# EAGLE design f103Ard (EAGLE 4.13)
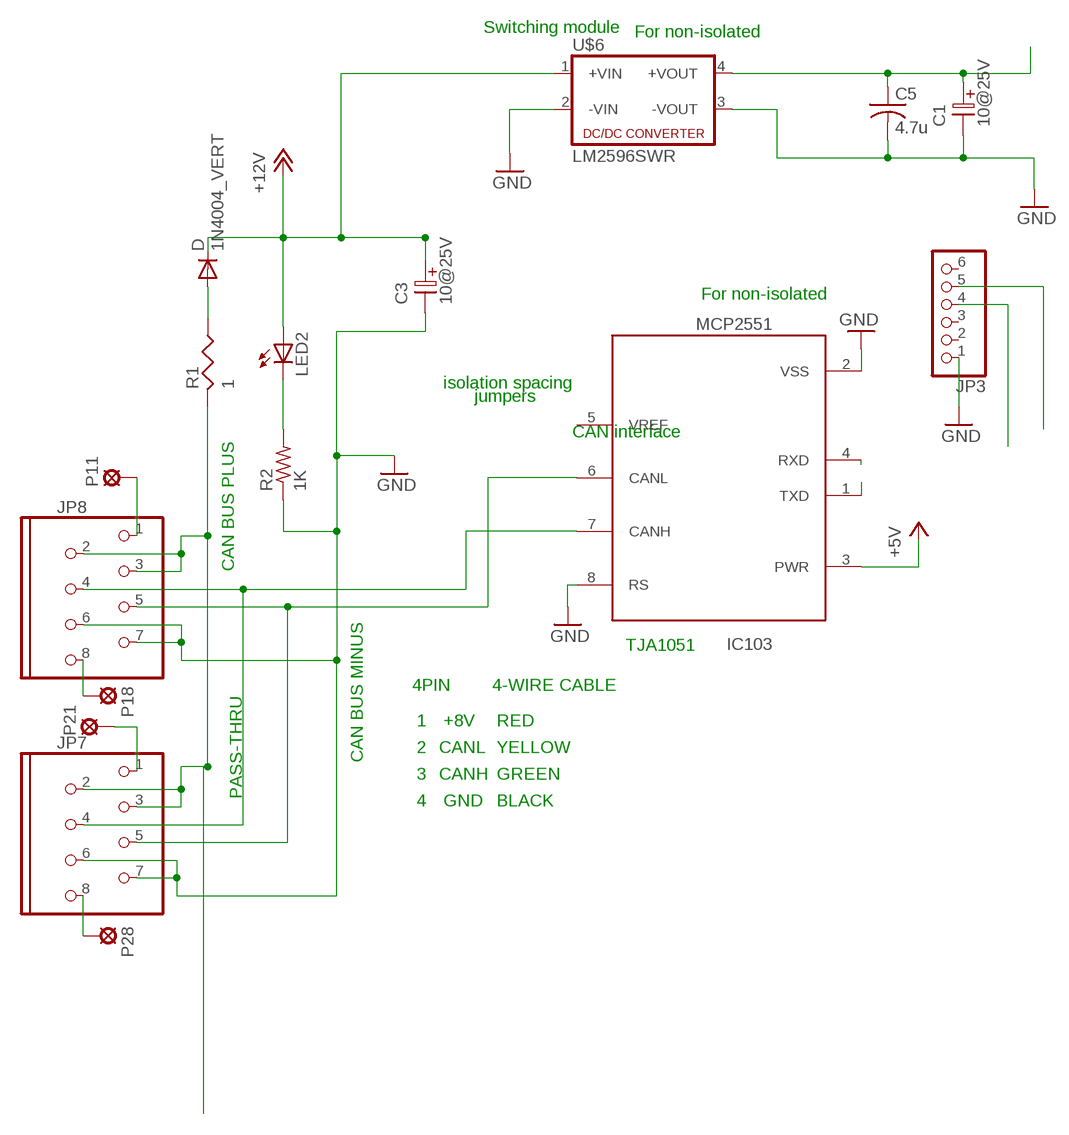
[diagram p0: schematic, sheet 1]

## Parts
C1  10@25V  ELC-2,5L  [ES-2,5L]
C3  10@25V  ELC-2,5L  [ES-2,5L]
C5  4.7u  C-USC0603  [C0603]
D  1N4004_VERT  [DO41-10_VERT]
IC103  MCP2551  [SO-08]
JP3  PINHD-1X6  [1X06]
JP7  MOD8P8C  [MOD8P8C]
JP8  MOD8P8C  [MOD8P8C]
LED2  LEDCHIPLED_0805  [CHIPLED_0805]
P11  SOLPAD035  [SOLDPAD035]
P18  SOLPAD035  [SOLDPAD035]
P21  SOLPAD035  [SOLDPAD035]
P28  SOLPAD035  [SOLDPAD035]
R1  1  RESUS-S2,5  [RS-2,5]
R2  1K  R-US_R0603  [R0603]
U$6  LM2596SWR  [LM2596SW]

## Nets
+5V: IC103.3(PWR)
+12V: C3.1 D.C LED2.A U$6.1(+VIN)
+12V_RESISTORED: D.A R1.1
CAN_RAW_PLUS: JP7.2 JP7.3 JP8.2 JP8.3 R1.2
CANCABLE_1_1: JP8.1 P11.MP
CANCABLE_1_8: JP8.8 P18.MP
CANCABLE_2_1: JP7.1 P21.MP
CANCABLE_2_8: JP7.8 P28.MP
CANRX: IC103.4(RXD)
CANTX: IC103.1(TXD)
GND: C1.2 C3.2 C5.2 IC103.2(VSS) IC103.8(RS) JP3.1 JP7.6 JP7.7 JP8.6 JP8.7 R2.1 U$6.2(-VIN) U$6.3(-VOUT)
LED_BUS_PWR: LED2.C R2.2
MCP2551_CANH: IC103.7(CANH) JP7.4 JP8.4
MCP2551_CANL: IC103.6(CANL) JP7.5 JP8.5
N$1: C1.1 C5.1 U$6.4(+VOUT)
PA9_USART1_TX: JP3.5
PA10_USART1_RX: JP3.4
Unconnected: IC103.5(VREF) JP3.2 JP3.3 JP3.6

## Notes on the sheet
- Switching module | For non-isolated
- For non-isolated
- isolation spacing
- jumpers
- CAN interface
- CAN BUS PLUS
- TJA1051
- PASS-THRU | 4PIN | 4-WIRE CABLE
- 1 | +8V | RED
- 2 | CANL | YELLOW
- CAN BUS MINUS
- 3 | CANH | GREEN
- 4 | GND | BLACK

## Library data of the parts
C1 C3 = DEH:ELC-2,5L
C5 = rcl:C-US: CAPACITOR, American symbol
D = diode:1N4004_VERT
IC103 = texas:MCP2551
JP3 = pinhead:PINHD-1X6: PIN HEADER
JP7 JP8 = DEH:MOD8P8C
LED2 = led:LED: LED OSRAM: - CHIPLED LG R971, LG N971, LY N971, LG Q971, LY Q971, LO R971, LY R971 LH N974, LH R974 LS Q976, LO Q976, LY Q976 LO Q996 - Hyper CHIPLED LW Q18S LB Q993, LB Q99A, LB R99A - SideLED LS A670, LO A670, LY A670, LG A670, LP A670 LB A673, LV A673, LT A673, LW A673 LH A674 LY A675 LS A676, LA A676, LO A676, LY A676, LW A676 LS A679, LY A679, LG A679 - Hyper Micro SIDELED® LS Y876, LA Y876, LO Y876, LY Y876 LT Y87S - SmartLED LW L88C, LW L88S LB L89C, LB L89S, LG L890 LS L89K, LO L89K, LY L89K LS L896, LA L896, LO L896, LY L896 - TOPLED LS T670, LO T670, LY T670, LG T670, LP T670 LSG T670, LSP T670, LSY T670, LOP T670, LYG T670 LG T671, LOG T671, LSG T671 LB T673, LV T673, LT T673, LW T673 LH T674 LS T676, LA T676, LO T676, LY T676, LB T676, LH T676, LSB T676, LW T676 LB T67C, LV T67C, LT T67C, LS T67K, LO T67K, LY T67K, LW E67C LS E67B, LA E67B, LO E67B, LY E67B, LB E67C, LV E67C, LT E67C LW T67C LS T679, LY T679, LG T679 LS T770, LO T770, LY T770, LG T770, LP T770 LB T773, LV T773, LT T773, LW T773 LH T774 LS E675, LA E675, LY E675, LS T675 LS T776, LA T776, LO T776, LY T776, LB T776 LHGB T686 LT T68C, LB T68C - Hyper Mini TOPLED® LB M676 - Mini TOPLED Santana® LG M470 LS M47K, LO M47K, LY M47K Source: http://www.osram.convergy.de/
P11 P18 P21 P28 = solpad:SOLPAD035
R1 = DEH:RESUS-S2,5
R2 = rcl:R-US_: RESISTOR, American symbol
U$6 = dc-dc-converter:LM2596SWR

## Board
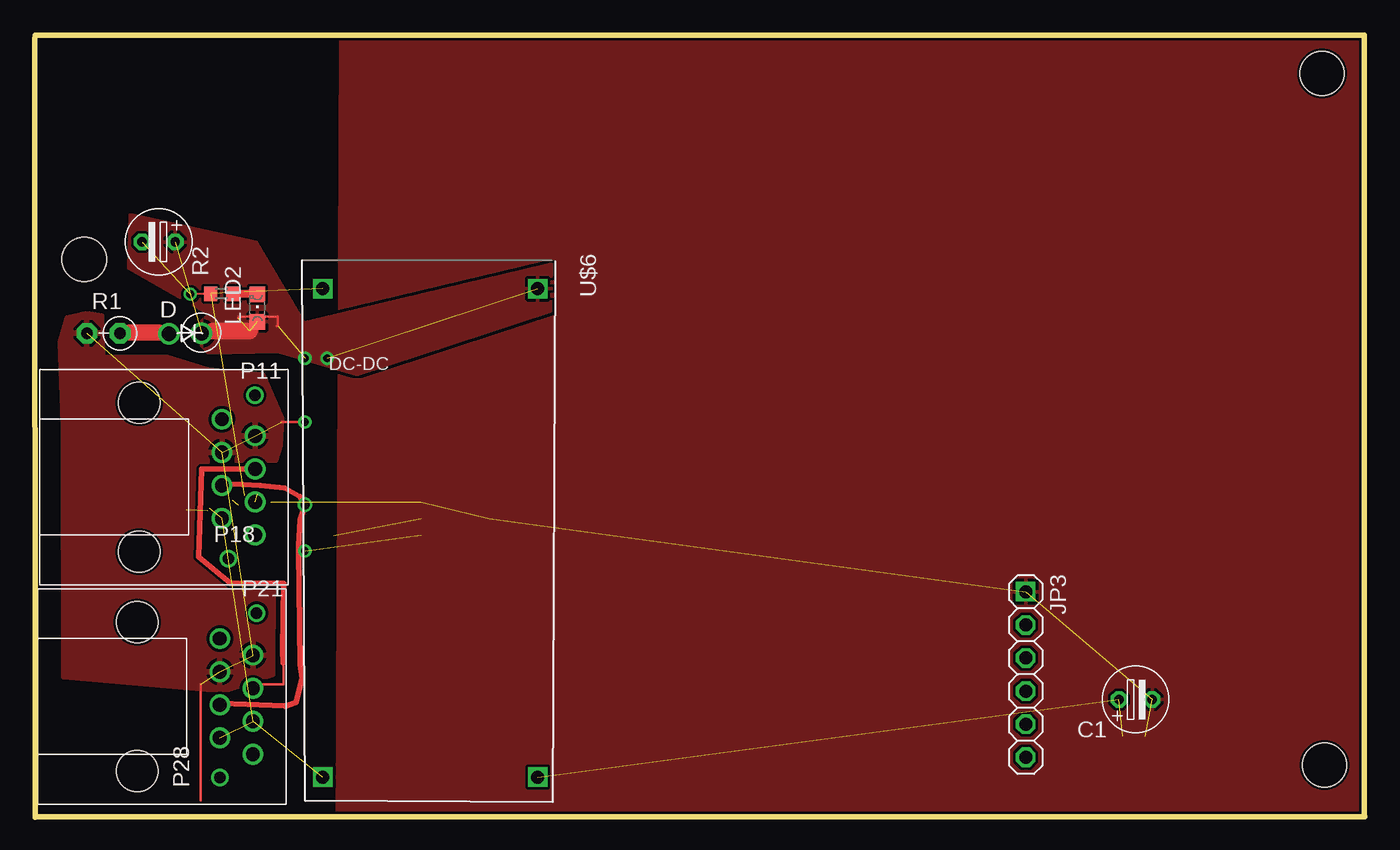
[diagram p1: board, top side]
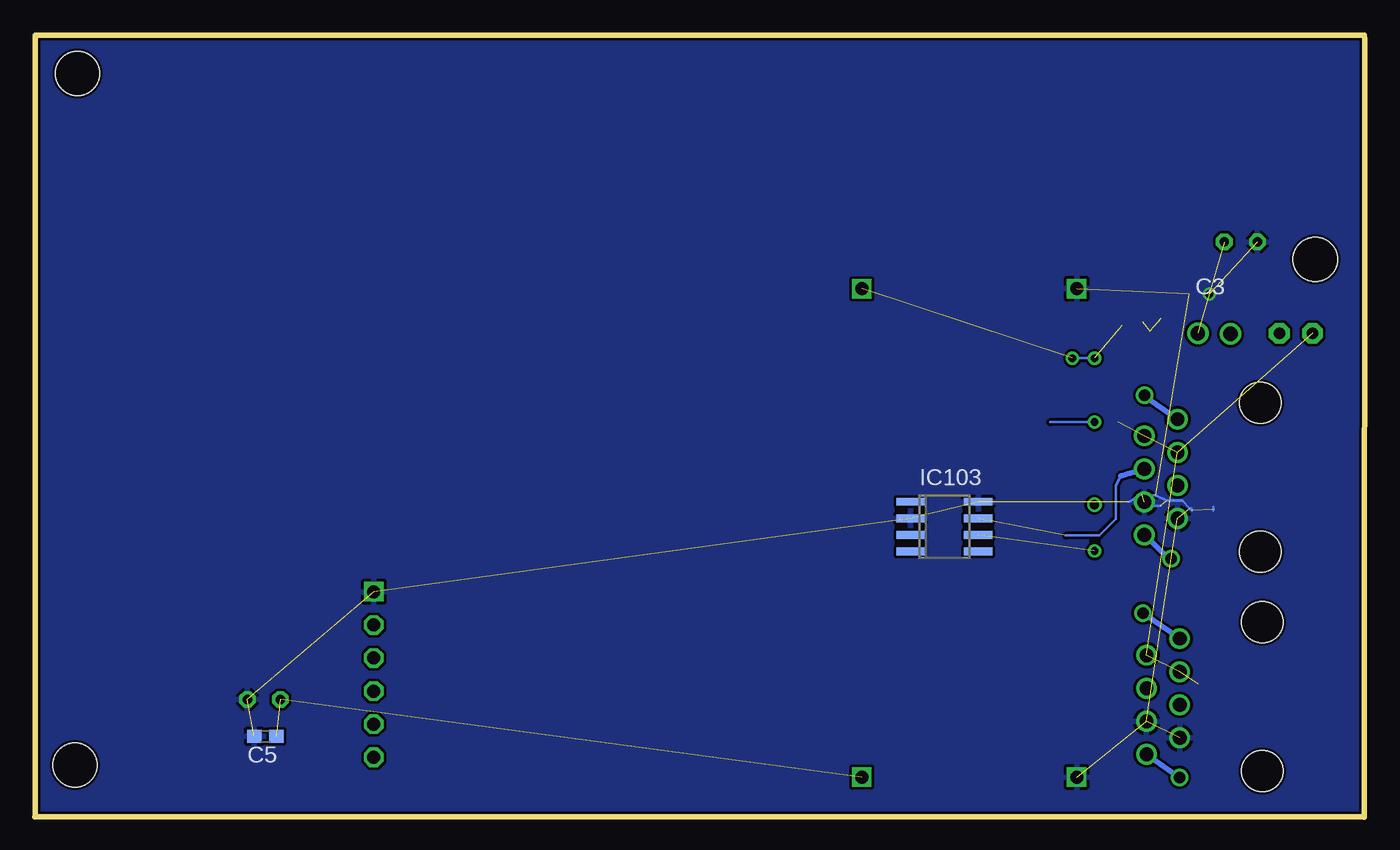
[diagram p2: board, bottom side, seen from below]

Size 102.07 x 60.02 mm. Coordinates in mm from the lower left corner, seen from the top.
Outline: 0.02,0 0.02,0.01
Outline: 0.02,0.01 0,59.8
Outline: 102.07,0.01 0.02,0.01
Outline: 0.02,60.02 102.02,60.02 102.02,0.02
Copper layers (1*16): Top 0.035mm / dielectric 1.5mm / Bottom 0.035mm
Design rules "default": minimum track width 8mil, minimum drill 0.6mm, track to track 8mil, track to pad 8mil, pad to pad 10mil, via to via 8mil, smd to smd 0mil, copper to edge 8mil, drill to drill 8mil, minimum pad ring 8mil, minimum via ring 8mil, stop-mask expansion 4mil, vias tented up to drill 0mil, thermal gap 10mil
Holes 3.4 mm at 3.78,42.82 98.77,57.07 98.98,3.99

### Footprints (pad centres in the part's own frame; a part is rotated, then mirrored left to right if it is on the bottom)
ES-2,5L = drill 0.711 pad 1.27 octagon: 1 0,0; 2 2.54,0
C0603 = smd 1.1 x 1: 1 -0.85,0; 2 0.85,0
DO41-10_VERT = drill 1.1 round: A 2.58,0.05; C 0.07,0
SO-08 = smd 0.6 x 2.2: 1 -1.905,-2.6; 2 -0.635,-2.6; 3 0.635,-2.6; 4 1.905,-2.6; 5 1.905,2.6; 6 0.635,2.6; 7 -0.635,2.6; 8 -1.905,2.6
1X06 = drill 1 square: 1 -6.35,0 | drill 1 octagon: 2 -3.81,0; 3 -1.27,0; 4 1.27,0; 5 3.81,0; 6 6.35,0
MOD8P8C = drill 1.067 pad 1.397 round: 1 -3.81,-2.54; 2 -2.54,0; 3 -1.27,-2.54; 4 0,0; 5 1.27,-2.54; 6 2.54,0; 7 3.81,-2.54; 8 5.08,0 | hole 3.175: -5.08,-8.89; 6.35,-8.89
CHIPLED_0805 = smd 1.2 x 1.2: A 0,-1.05; C 0,1.05
SOLDPAD035 = drill 0.889 pad 1.27 round: MP 0,0
RS-2,5 = drill 0.9 pad 1.6 octagon: 1 0,0; 2 2.54,0
R0603 = smd 1 x 1.1: 1 -0.85,0; 2 0.85,0
LM2596SW = drill 1 square: 1 0,16.5; 2 0,0; 3 37.5,0; 4 37.5,16.5

### Placement (x,y rotation side)
C1  83.2,9.03 0 top
C3  10.76,44.16 180 top
C5  84.35,6.21 180 bottom
D  12.86,37.14 180 top
IC103  32.24,22.3 270 bottom
JP3  76.04,10.94 270 top
JP7  16.73,9.89 270 top
JP8  16.89,26.73 270 top
LED2  17.07,39.07 0 top
P11  16.87,32.38 0 top
P18  14.85,19.84 0 top
P21  17.01,15.67 0 top
P28  14.19,3.05 0 top
R1  6.53,37.14 180 top
R2  14.32,40.18 0 top
U$6  22.08,40.56 270 top

### Tracks (layer width: path | path; a pad name or v marks a point on that pad's centre or on a via)
+12V  (via drill 0.6)  (5 unrouted)
  Top 0.203: D.C 12.72,36.85 | 15.6,38.32 15.62,38.42 18.62,38.42 18.62,37.72 18.55,37.68
  Top 0.813: D.C 13.59,37.3
  Top 1.27: 13.59,37.3 16.49,37.3
  Bottom 0.203: v22.42,35.22 v20.72,35.22
  pour Top: 13.36,38.61 12.3,37.62 12.34,36.64 13.29,35.61 18.65,35.73 24.71,33.96 39.58,38.83 39.66,42.45 20.62,37.91 16.95,44.12 7.32,46.25 7.19,42.15
+12V_RESISTORED
  Top 1.016: R1.1 7.29,37.2 | 9.49,37.2 D.A
  Top 1.27: 7.29,37.2 9.49,37.2
CAN_RAW_PLUS  (via drill 0.6)  (6 unrouted)
  Top 0.203: 12.72,1.29 12.72,10.18 | v20.72,30.32 19.12,30.32 18.92,30.33
  Bottom 0.203: v20.72,30.32 24.12,30.32
  pour Top: 18.15,32.31 18.94,30.56 18.8,28.52 18.46,27.41 14.19,27.37 12.44,26.96 12.44,20.64 18.27,17.92 18.25,10.97 14.47,9.71 2.21,10.78 2.17,30.16 1.93,36.46 2.48,38.31 3.99,38.64 5.12,38.47 5.19,35.29 10.09,35.33 13.29,34.31 17.46,33.95
CANCABLE_1_1
  Bottom 0.406: P11.MP 16.97,32.38 JP8.1
CANCABLE_1_8
  Bottom 0.406: P18.MP 14.93,19.79 JP8.8
CANCABLE_2_1
  Bottom 0.406: P21.MP 16.97,15.62 JP7.1
CANCABLE_2_8
  Bottom 0.406: P28.MP 14.14,2.99 JP7.8
GND  (via drill 0.6 pad 0.25)  (15 unrouted)
  Top 0.203: v11.92,40.14 R2.1
  Bottom 0.203: 15.79,23.9 16.09,23.9 | 15.79,23.9 15.69,23.9 | 15.63,23.94 15.79,23.9 | 18.09,24.2 17.1,24.8 16.04,24.7 15.19,24.3 13.99,24.3 13.39,23.7 13.34,23.65 | 13.34,23.65 13.26,23.57 | 11.59,23.8 11.58,23.67 11.59,23.6 11.59,23.53 | 13.34,23.65 13.29,23.7 13.24,23.52 | v11.92,40.14 11.89,40.11
  pour Bottom: -0.1,-0.02 0.14,59.92 102.24,60.26 101.87,0.1
  pour Top (rank 4): 23.41,59.71 102.11,60.02 102,-0.17 23.14,-0.12
LED_BUS_PWR
  Top 0.203: R2.2 15.59,40.2 | LED2.C 17.14,40.09 16.49,40.2
  Top 0.61: 15.59,40.2 16.49,40.2
MCP2551_CANH  (1 unrouted)
  Top 0.203: JP7.4 16.53,10.18 19.07,10.18 19.07,11.45 19.06,11.84
  Top 0.406: 19.06,11.84 19.02,12.8 19.09,17.92 15.02,17.92 12.58,19.98 12.78,26.71 JP8.4
  Bottom 0.203: 18.71,26.19 18.92,25.75 19.07,25.42 19.07,22.88 20.34,21.61 22.88,21.61 22.92,21.62
  Bottom 0.406: JP8.4 18.71,26.19
MCP2551_CANL  (via drill 0.6, 0.7)  (1 unrouted)
  Top 0.203: 14.29,8.72 14.01,8.66 | 14.29,8.72 18.67,8.48 | 20.31,24.61 20.71,24.49 v20.73,23.98 | JP8.5 14.38,25.5 14.38,25.52 | 14.29,8.72 13.99,8.91 JP7.5 | v20.72,20.42 20.42,20.42 20.23,20.42
  Top 0.254: 19.17,8.53 19.21,8.51 | 14.29,8.72 14.2,8.67
  Top 0.406: v20.73,23.98 20.35,22.81 20.22,20.86 20.23,20.42 20.36,11.73 20.5,10.69 20.06,8.81 19.21,8.51 | 14.36,25.52 14.38,25.52 14.93,25.58 15.95,25.52 17.29,25.45 19.17,25.28 20.31,24.61 20.72,23.95 | 14.29,8.72 19.17,8.53
N$1  (2 unrouted)
N$4
  Top 0.203: 0.02,60.02 102.02,60.02